# EAGLE board cpu (EAGLE 9.2.2), part 1 of 2
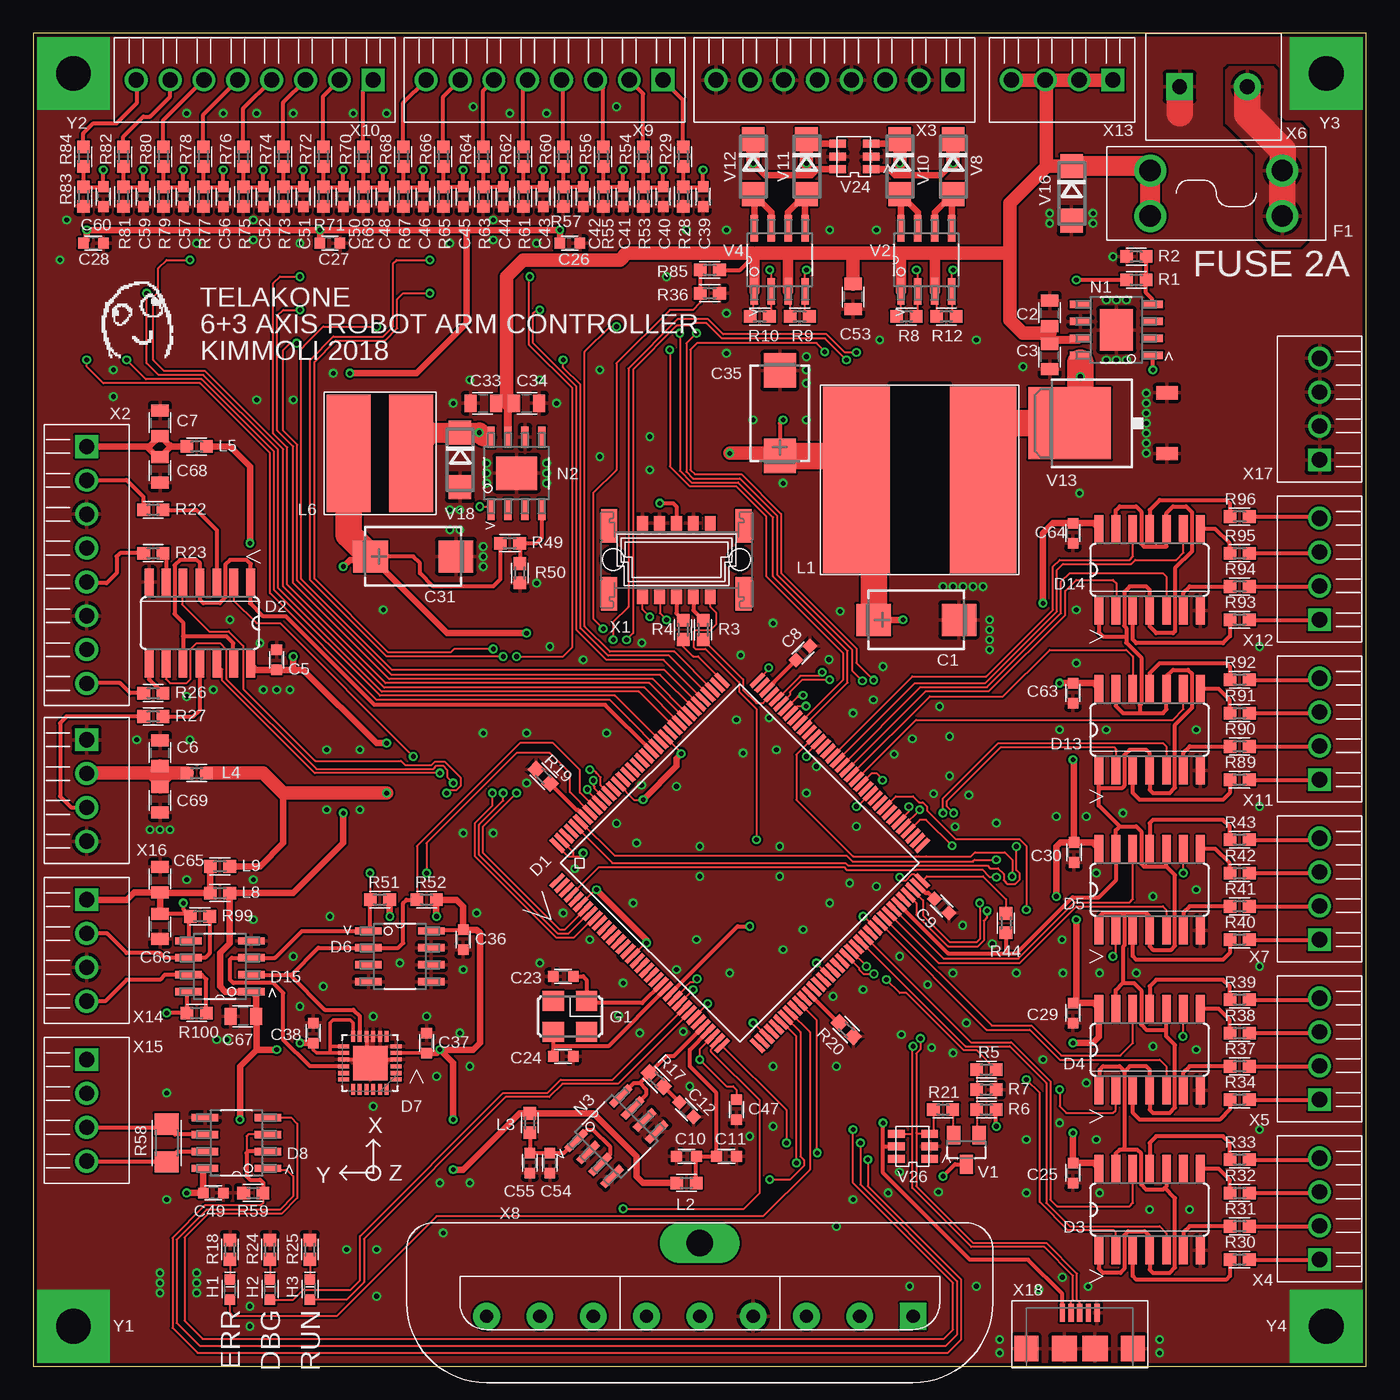
[diagram p8: board, top side]
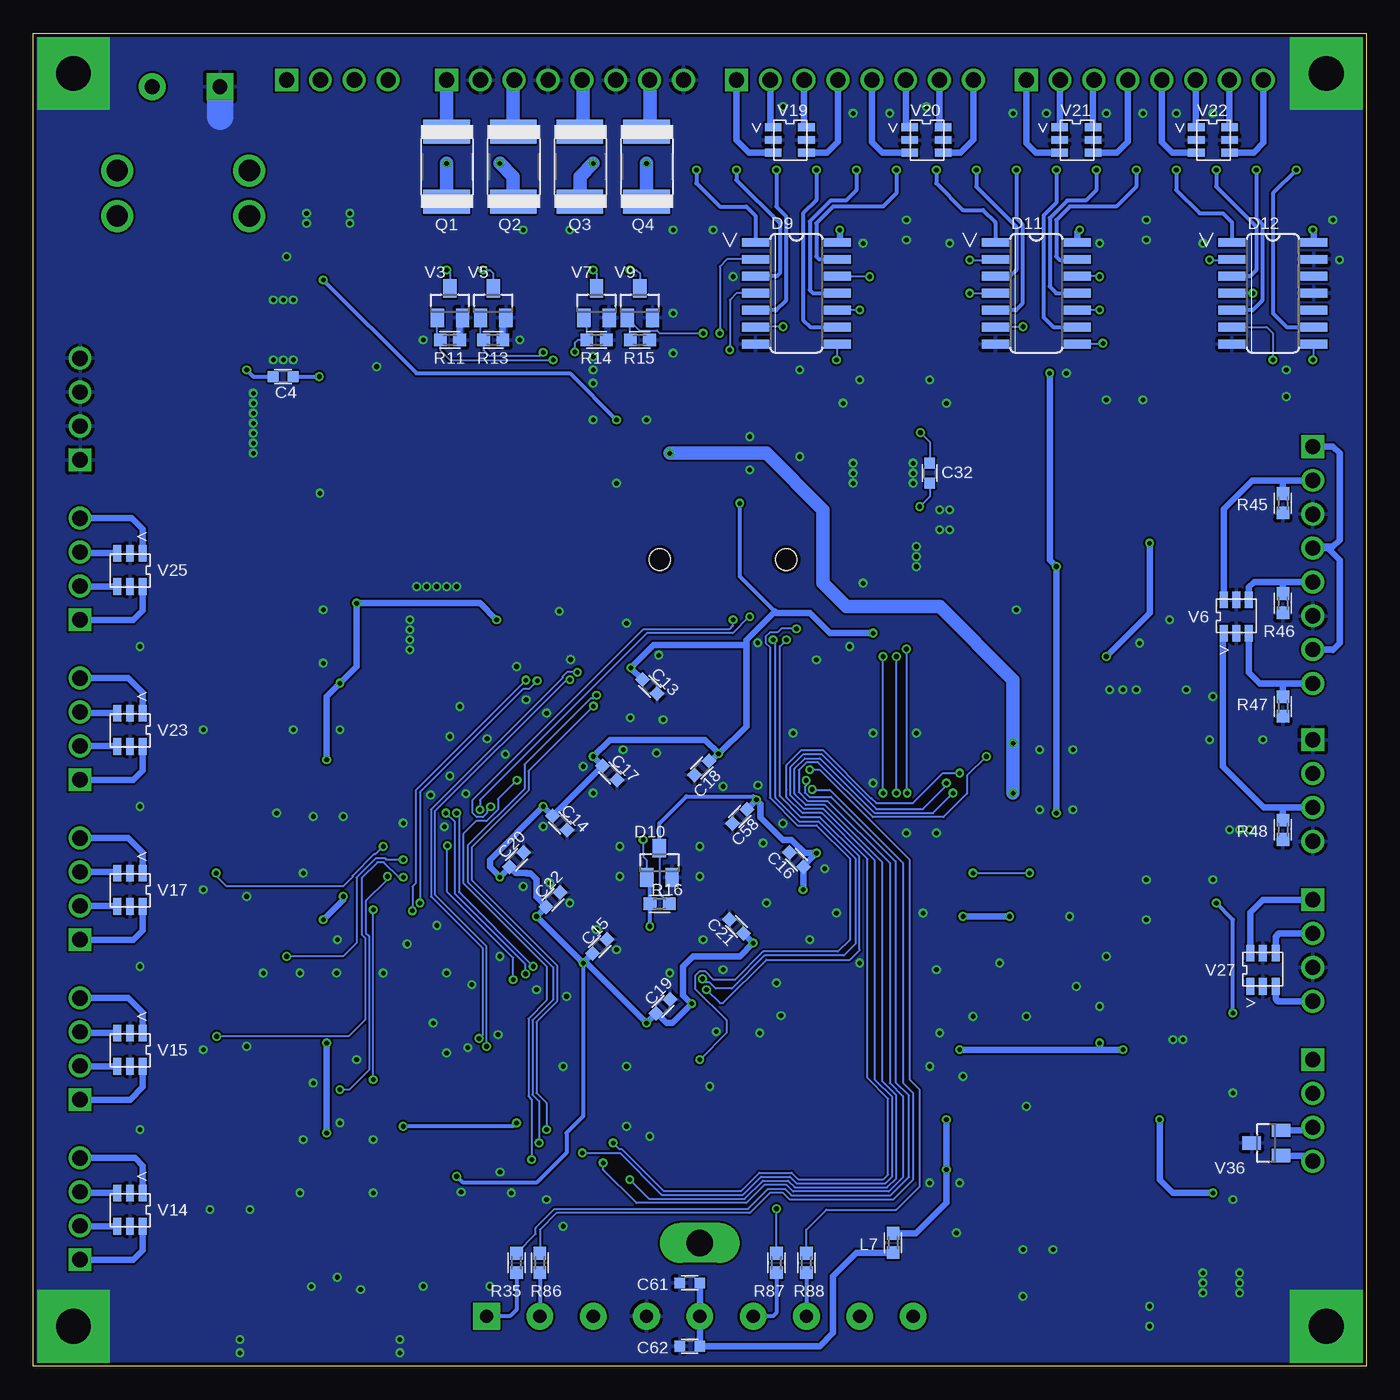
[diagram p9: board, bottom side, seen from below]

Size 100 x 100 mm. Coordinates in mm from the lower left corner, seen from the top.
Outline: 0,0 100,0 100,100 0,100 0,0
Copper layers (1*16): Top 0.035mm / dielectric 1.5mm / Bottom 0.035mm
Design rules "ITeadstudio": minimum track width 6mil, minimum drill 12mil, track to track 6mil, track to pad 6mil, pad to pad 6mil, via to via 6mil, smd to smd 0mil, copper to edge 10mil, drill to drill 10mil, minimum pad ring 10mil, minimum via ring 6mil, stop-mask expansion 2mil, vias tented up to drill 100mil, thermal gap 10mil
Net classes: 2 other: width 0.3 mm, drill 0.3 mm, clearance 1 mm to class 1
tRestrict: area 38.2,24.5 to 42.2,28; area 64.2,59.5 to 68.8,73.8; area 25.2,64 to 26.8,73

## Footprints (pad centres in the part's own frame; a part is rotated, then mirrored left to right if it is on the bottom)
CT7343 = smd 2.6 x 2.4: + 3.2,0; - -3.2,0
C0805 = smd 0.9 x 1.3: 1 -0.95,0; 2 0.95,0
C0603 = smd 0.8 x 0.8: 1 -0.75,0; 2 0.75,0
OMAT_IC_2_C0603 = smd 0.8 x 0.8: 1 -0.75,0; 2 0.75,0
OMAT_IC_2_C0805 = smd 0.9 x 1.3: 1 -0.95,0; 2 0.95,0
LQFP-144 = smd 0.34 x 1.35: 1 -8.75,-10.625; 2 -8.25,-10.625; 3 -7.75,-10.625; 4 -7.25,-10.625; 5 -6.75,-10.625; 6 -6.25,-10.625; 7 -5.75,-10.625; 8 -5.25,-10.625; 9 -4.75,-10.625; 10 -4.25,-10.625; 11 -3.75,-10.625; 12 -3.25,-10.625; 13 -2.75,-10.625; 14 -2.25,-10.625; 15 -1.75,-10.625; 16 -1.25,-10.625; 17 -0.75,-10.625; 18 -0.25,-10.625; 19 0.25,-10.625; 20 0.75,-10.625; 21 1.25,-10.625; 22 1.75,-10.625; 23 2.25,-10.625; 24 2.75,-10.625; 25 3.25,-10.625; 26 3.75,-10.625; 27 4.25,-10.625; 28 4.75,-10.625; 29 5.25,-10.625; 30 5.75,-10.625; 31 6.25,-10.625; 32 6.75,-10.625; 33 7.25,-10.625; 34 7.75,-10.625; 35 8.25,-10.625; 36 8.75,-10.625; 73 8.75,10.625; 74 8.25,10.625; 75 7.75,10.625; 76 7.25,10.625; 77 6.75,10.625; 78 6.25,10.625; 79 5.75,10.625; 80 5.25,10.625; 81 4.75,10.625; 82 4.25,10.625; 83 3.75,10.625; 84 3.25,10.625; 85 2.75,10.625; 86 2.25,10.625; 87 1.75,10.625; 88 1.25,10.625; 89 0.75,10.625; 90 0.25,10.625; 91 -0.25,10.625; 92 -0.75,10.625; 93 -1.25,10.625; 94 -1.75,10.625; 95 -2.25,10.625; 96 -2.75,10.625; 97 -3.25,10.625; 98 -3.75,10.625; 99 -4.25,10.625; 100 -4.75,10.625; 101 -5.25,10.625; 102 -5.75,10.625; 103 -6.25,10.625; 104 -6.75,10.625; 105 -7.25,10.625; 106 -7.75,10.625; 107 -8.25,10.625; 108 -8.75,10.625 | smd 1.35 x 0.34: 37 10.625,-8.75; 38 10.625,-8.25; 39 10.625,-7.75; 40 10.625,-7.25; 41 10.625,-6.75; 42 10.625,-6.25; 43 10.625,-5.75; 44 10.625,-5.25; 45 10.625,-4.75; 46 10.625,-4.25; 47 10.625,-3.75; 48 10.625,-3.25; 49 10.625,-2.75; 50 10.625,-2.25; 51 10.625,-1.75; 52 10.625,-1.25; 53 10.625,-0.75; 54 10.625,-0.25; 55 10.625,0.25; 56 10.625,0.75; 57 10.625,1.25; 58 10.625,1.75; 59 10.625,2.25; 60 10.625,2.75; 61 10.625,3.25; 62 10.625,3.75; 63 10.625,4.25; 64 10.625,4.75; 65 10.625,5.25; 66 10.625,5.75; 67 10.625,6.25; 68 10.625,6.75; 69 10.625,7.25; 70 10.625,7.75; 71 10.625,8.25; 72 10.625,8.75; 109 -10.625,8.75; 110 -10.625,8.25; 111 -10.625,7.75; 112 -10.625,7.25; 113 -10.625,6.75; 114 -10.625,6.25; 115 -10.625,5.75; 116 -10.625,5.25; 117 -10.625,4.75; 118 -10.625,4.25; 119 -10.625,3.75; 120 -10.625,3.25; 121 -10.625,2.75; 122 -10.625,2.25; 123 -10.625,1.75; 124 -10.625,1.25; 125 -10.625,0.75; 126 -10.625,0.25; 127 -10.625,-0.25; 128 -10.625,-0.75; 129 -10.625,-1.25; 130 -10.625,-1.75; 131 -10.625,-2.25; 132 -10.625,-2.75; 133 -10.625,-3.25; 134 -10.625,-3.75; 135 -10.625,-4.25; 136 -10.625,-4.75; 137 -10.625,-5.25; 138 -10.625,-5.75; 139 -10.625,-6.25; 140 -10.625,-6.75; 141 -10.625,-7.25; 142 -10.625,-7.75; 143 -10.625,-8.25; 144 -10.625,-8.75
SO14 = smd 0.66 x 2.032: 1 -3.81,-3.073; 2 -2.54,-3.073; 3 -1.27,-3.073; 4 0,-3.073; 5 1.27,-3.073; 6 2.54,-3.073; 7 3.81,-3.073; 8 3.81,3.073; 9 2.54,3.073; 10 1.27,3.073; 11 0,3.073; 12 -1.27,3.073; 13 -2.54,3.073; 14 -3.81,3.073
SOIC8-N_MC = smd 1.981 x 0.559: 1 -2.362,1.905; 2 -2.362,0.635; 3 -2.362,-0.635; 4 -2.362,-1.905; 5 2.362,-1.905; 6 2.362,-0.635; 7 2.362,0.635; 8 2.362,1.905
QFN50P400X400X100-25N = smd 0.813 x 0.305: 1 -1.981,1.245; 2 -1.981,0.762; 3 -1.981,0.254; 4 -1.981,-0.254; 5 -1.981,-0.762; 6 -1.981,-1.245; 13 1.981,-1.245; 14 1.981,-0.762; 15 1.981,-0.254; 16 1.981,0.254; 17 1.981,0.762; 18 1.981,1.245 | smd 0.305 x 0.813: 7 -1.245,-1.981; 8 -0.762,-1.981; 9 -0.254,-1.981; 10 0.254,-1.981; 11 0.762,-1.981; 12 1.245,-1.981; 19 1.245,1.981; 20 0.762,1.981; 21 0.254,1.981; 22 -0.254,1.981; 23 -0.762,1.981; 24 -1.245,1.981 | smd 2.591 x 2.591: 25 -0.025,0
SOT23 = smd 1 x 1.4: 1 -0.95,-1.1; 2 0.95,-1.1; 3 0,1.1
OMAT_IC_2_SOIC8-N_MC = smd 1.981 x 0.559: 1 -2.362,1.905; 2 -2.362,0.635; 3 -2.362,-0.635; 4 -2.362,-1.905; 5 2.362,-1.905; 6 2.362,-0.635; 7 2.362,0.635; 8 2.362,1.905
KEYSTONE-3568 = drill 1.6: 1 -4.96,1.7; 2 4.96,1.7; 3 4.96,-1.7; 4 -4.96,-1.7
X_3225 = smd 1.6 x 1.5: 1 -1.25,-1.15; 2 1.25,-1.15; 3 1.25,1.15; 4 -1.25,1.15
CHIP-LED0603 = smd 0.8 x 0.8: A -0.75,0; C 0.75,0
SDR1307 = smd 5 x 14: 1 -4.75,0; 2 4.75,0
R0603 = smd 0.95 x 0.95: 1 -0.725,0; 2 0.725,0
OMAT_IC_2_R0603 = smd 0.95 x 0.95: 1 -0.725,0; 2 0.725,0
VLP8040 = smd 3.3 x 8.8: 1 -2.35,0; 2 2.35,0
SOIC8-N-EP = smd 1.6 x 0.559: 1 -2.7,1.905; 2 -2.7,0.635; 3 -2.7,-0.635; 4 -2.7,-1.905; 5 2.7,-1.905; 6 2.7,-0.635; 7 2.7,0.635; 8 2.7,1.905 | smd 2.5 x 3.1: EP 0,0
OMAT_IC_2_R1812 = smd 1.8 x 3.5: 1 -2.625,0; 2 2.625,0
PASSIIVIT_R0603 = smd 0.95 x 0.95: 1 -0.725,0; 2 0.725,0
R1206 = smd 1.6 x 1.803: 1 -1.422,0; 2 1.422,0
OMAT_IC_2_SOT23 = smd 1 x 1.4: 1 -0.95,-1.1; 2 0.95,-1.1; 3 0,1.1
OMAT_IC_2_SOT23-6 = smd 1.25 x 0.6: 1 -1.25,0.95; 2 -1.25,0; 3 -1.25,-0.95; 4 1.25,-0.95; 5 1.25,0; 6 1.25,0.95
DO214AC = smd 1.8 x 1.7: A 2.05,0; C -2.05,0
DPACK = smd 1 x 1.6: 1 -2.28,-4.8; 3 2.28,-4.8 | smd 5.4 x 6.2: 2 0,2.5
SOT23-6 = smd 1.25 x 0.6: 1 -1.25,0.95; 2 -1.25,0; 3 -1.25,-0.95; 4 1.25,-0.95; 5 1.25,0; 6 1.25,0.95
LIITTIMET_15110102601 = smd 0.8 x 1.1: A1 -2.54,2.765; A2 -1.27,2.765; A3 0,2.765; A4 1.27,2.765; A5 2.54,2.765; B1 -2.54,-2.74; B2 -1.27,-2.74; B3 0,-2.74; B4 1.27,-2.74; B5 2.54,-2.74 | smd 1.2 x 2.5: M1 -5.045,2.55; M2 -5.045,-2.55; M3 5.045,-2.55; M4 5.045,2.55 | hole 1.6: -4.738,-0.022; 4.738,-0.022
OMAT_IC_2_MPT0.5/8-2.54 = drill 1.143 square: 1 0,0 | drill 1.143: 2 2.54,0; 3 5.08,0; 4 7.62,0; 5 10.16,0; 6 12.7,0; 7 15.24,0; 8 17.78,0
MPT0.5/8-2.54 = drill 1.143 square: 1 0,0 | drill 1.143: 2 2.54,0; 3 5.08,0; 4 7.62,0; 5 10.16,0; 6 12.7,0; 7 15.24,0; 8 17.78,0
MPT0.5/4-2.54 = drill 1.143 square: 1 0,0 | drill 1.143: 2 2.54,0; 3 5.08,0; 4 7.62,0
TE_RUUVILIITIN2 = drill 1.1 pad 2 square: 1 0,0 | drill 1.1 pad 2: 2 5.08,0
PS-JOYSTICK = drill 1 pad 2 square: 1 0,0 | drill 1 pad 2: 2 -4,0; 3 -8,0; 4 -12,0; 5 -16,0; 6 -20,0; 7 -24,0; 8 -28,0; 9 -32,0 | drill 2 long: 10 -16,5.5
629105136821 = smd 0.4 x 1.35: 1 -1.3,0; 2 -0.65,0; 3 0,0; 4 0.65,0; 5 1.3,0 | smd 1.8 x 1.9: Z1 -4,-2.675; Z4 4,-2.675 | smd 1.9 x 1.9: Z2 -1.15,-2.675; Z3 1.15,-2.675
PTH-2.6-5.5SQ = drill 2.6 pad 5.45 square: 1 0,0

## Placement (x,y rotation side)
C1  220u 16V D  [CT7343]  66.25,56 180 top
C2  2u2 50V 0805  [C0805]  76.25,79 90 top
C3  2u2 50V 0805  [C0805]  76.25,75.75 270 top
C4  10n  [C0603]  81.25,74.25 180 bottom
C5  [OMAT_IC_2_C0603]  18.25,53 90 top
C6  [OMAT_IC_2_C0805]  9.5,46 90 top
C7  [OMAT_IC_2_C0805]  9.5,70.75 90 top
C8  2u2  [C0603]  57.75,53.5 45 top
C9  2u2  [C0603]  68.15,34.53 315 top
C10  100n  [C0603]  49,15.75 180 top
C11  2u2  [C0603]  52,15.75 0 top
C12  2u2  [C0603]  49,19.25 315 top
C13  100n  [C0603]  53.75,51 315 bottom
C14  100n  [C0603]  60.5,40.75 315 bottom
C15  100n  [C0603]  57.5,31.5 45 bottom
C16  100n  [C0603]  42.75,38 135 bottom
C17  100n  [C0603]  56.75,44.5 315 bottom
C18  100n  [C0603]  49.85,44.88 225 bottom
C19  100n  [C0603]  52.75,27 45 bottom
C20  100n  [C0603]  63.75,38 45 bottom
C21  100n  [C0603]  47.25,33 135 bottom
C22  100n  [C0603]  61,35 45 bottom
C23  22p  [C0603]  39.75,29.25 180 top
C24  22p  [C0603]  39.75,23.25 0 top
C25  [OMAT_IC_2_C0603]  78,14.5 270 top
C26  100n  [C0603]  40.25,84.25 0 top
C27  100n  [C0603]  22.25,84.25 0 top
C28  100n  [C0603]  4.5,84.25 0 top
C29  [OMAT_IC_2_C0603]  78,26.5 270 top
C30  [OMAT_IC_2_C0603]  78.08,38.54 270 top
C31  220u 16V D  [CT7343]  28.5,60.75 180 top
C32  10n  [C0603]  32.75,67 270 bottom
C33  2u2 50V 0805  [C0805]  33.75,72.25 180 top
C34  2u2 50V 0805  [C0805]  37,72.25 0 top
C35  220u 16V D  [CT7343]  56,71.5 270 top
C36  100n  [C0603]  32.25,32 270 top
C37  100n  [C0603]  29.5,24.25 90 top
C38  2u2  [C0603]  21,25 90 top
C39  10n  [OMAT_IC_2_C0603]  50.25,87.75 270 top
C40  [OMAT_IC_2_C0603]  47.25,87.75 270 top
C41  [OMAT_IC_2_C0603]  44.25,87.75 270 top
C42  [OMAT_IC_2_C0603]  41.25,87.75 270 top
C43  [OMAT_IC_2_C0603]  38.25,87.75 270 top
C44  [OMAT_IC_2_C0603]  35.25,87.75 270 top
C45  [OMAT_IC_2_C0603]  32.25,87.75 270 top
C46  [OMAT_IC_2_C0603]  29.25,87.75 270 top
C47  10n  [C0603]  52.75,19.25 270 top
C48  [OMAT_IC_2_C0603]  26.25,87.75 270 top
C49  100n  [C0603]  13.5,13 0 top
C50  [OMAT_IC_2_C0603]  23.25,87.75 270 top
C51  [OMAT_IC_2_C0603]  20.25,87.75 270 top
C52  [OMAT_IC_2_C0603]  17.25,87.75 270 top
C53  2u2 50V 0805  [C0805]  61.5,80.25 270 top
C54  2u2  [C0603]  38.75,15.25 270 top
C55  100n  [C0603]  37.25,15.25 270 top
C56  [OMAT_IC_2_C0603]  14.25,87.75 270 top
C57  [OMAT_IC_2_C0603]  11.25,87.75 270 top
C58  100n  [C0603]  47,41.25 225 bottom
C59  [OMAT_IC_2_C0603]  8.25,87.75 270 top
C60  [OMAT_IC_2_C0603]  5.25,87.75 270 top
C61  100n  [C0603]  50.75,6.25 180 bottom
C62  2u2  [C0603]  50.75,1.5 180 bottom
C63  [OMAT_IC_2_C0603]  78,50.5 270 top
C64  [OMAT_IC_2_C0603]  78,62.5 270 top
C65  [OMAT_IC_2_C0805]  9.5,36.5 90 top
C66  [OMAT_IC_2_C0805]  9.5,33 270 top
C67  [OMAT_IC_2_C0805]  15.75,26.25 180 top
C68  [OMAT_IC_2_C0805]  9.5,67.25 270 top
C69  [OMAT_IC_2_C0805]  9.5,42.5 270 top
D1  STM32F407ZG  [LQFP-144]  53,37.75 315 top
D2  74AHCT125  [SO14]  12.5,55.75 180 top
D3  74AHCT125  [SO14]  83.75,11.75 0 top
D4  74AHCT125  [SO14]  83.75,23.75 0 top
D5  74AHCT125  [SO14]  83.75,35.75 0 top
D6  LM75BD  [SOIC8-N_MC]  27.5,30.75 0 top
D7  IIS328DQTR  [QFN50P400X400X100-25N]  25.25,22.75 180 top
D8  MAX3430_SA  [SOIC8-N_MC]  15.25,16.75 180 top
D9  74AHC14  [SO14]  42.75,80.5 270 bottom
D10  RT9818C-29GV  [SOT23]  53.03,37.77 0 bottom
D11  74AHC14  [SO14]  24.75,80.5 270 bottom
D12  74AHC14  [SO14]  7,80.5 270 bottom
D13  74AHCT125  [SO14]  83.75,47.75 0 top
D14  74AHCT125  [SO14]  83.75,59.75 0 top
D15  PCA9517  [OMAT_IC_2_SOIC8-N_MC]  14,30 180 top
F1  MINIBLADE-FUSEHOLDER-3568  [KEYSTONE-3568]  88.75,88 180 top
G1  25MHz  [X_3225]  40.25,26.25 180 top
H1  RED  [CHIP-LED0603]  14.75,5.75 90 top
H2  GRN  [CHIP-LED0603]  17.75,5.75 90 top
H3  GRN  [CHIP-LED0603]  20.75,5.75 90 top
L1  SDR1307-15UH  [SDR1307]  66.5,66.5 180 top
L2  IND0603  [R0603]  49,13.75 180 top
L3  IND0603  [R0603]  37.25,18.25 90 top
L4  IND0603  [OMAT_IC_2_R0603]  12.25,44.5 0 top
L5  IND0603  [OMAT_IC_2_R0603]  12.25,69 0 top
L6  VLP8040-47U  [VLP8040]  26,68.5 180 top
L7  IND0603  [R0603]  35.5,9.25 90 bottom
L8  IND0603  [OMAT_IC_2_R0603]  14,35.5 0 top
L9  IND0603  [OMAT_IC_2_R0603]  14,37.5 180 top
N1  TPS5430DDA  [SOIC8-N-EP]  81.25,77.75 180 top
N2  TPS5430DDA  [SOIC8-N-EP]  36.25,67 90 top
N3  MCP1501/SN  [SOIC8-N_MC]  43.75,17.25 45 top
Q1  PTC  [OMAT_IC_2_R1812]  69,90 90 bottom
Q2  PTC  [OMAT_IC_2_R1812]  64,90 90 bottom
Q3  PTC  [OMAT_IC_2_R1812]  59,90 90 bottom
Q4  PTC  [OMAT_IC_2_R1812]  54,90 90 bottom
R1  10k0  [R0603]  82.75,81.5 0 top
R2  3k24  [R0603]  82.75,83.25 180 top
R3  100R  [PASSIIVIT_R0603]  50.25,55.25 270 top
R4  100R  [PASSIIVIT_R0603]  48.75,55.25 270 top
R5  100R  [PASSIIVIT_R0603]  71.5,22.25 0 top
R6  31k6  [PASSIIVIT_R0603]  71.5,20.75 180 top
R7  10k0  [PASSIIVIT_R0603]  71.5,19.25 0 top
R8  2k00  [R0603]  65.5,78.75 180 top
R9  2k00  [R0603]  57.5,78.75 180 top
R10  2k00  [R0603]  54.5,78.75 180 top
R11  2k00  [R0603]  68.75,77 0 bottom
R12  2k00  [R0603]  68.5,78.75 180 top
R13  2k00  [R0603]  65.5,77 0 bottom
R14  2k00  [R0603]  57.75,77 0 bottom
R15  2k00  [R0603]  54.5,77 0 bottom
R16  2k00  [R0603]  53.01,34.69 0 bottom
R17  1k00  [R0603]  46.75,21.5 135 top
R18  499  [R0603]  14.75,8.75 270 top
R19  2k00  [R0603]  38.25,44.25 315 top
R20  2k00  [R0603]  61,25.25 135 top
R21  1k47  [PASSIIVIT_R0603]  68.25,19.25 0 top
R22  [OMAT_IC_2_R0603]  9,64.25 180 top
R23  [OMAT_IC_2_R0603]  9,61 180 top
R24  499  [R0603]  17.75,8.75 270 top
R25  499  [R0603]  20.75,8.75 270 top
R26  [OMAT_IC_2_R0603]  9,50.5 180 top
R27  [OMAT_IC_2_R0603]  9,48.75 180 top
R28  2k2  [OMAT_IC_2_R0603]  48.75,87.75 90 top
R29  5k90  [OMAT_IC_2_R0603]  48.75,90.75 90 top
R30  [OMAT_IC_2_R0603]  90.5,8 0 top
R31  [OMAT_IC_2_R0603]  90.5,10.5 0 top
R32  [OMAT_IC_2_R0603]  90.5,13 0 top
R33  [OMAT_IC_2_R0603]  90.5,15.5 0 top
R34  [OMAT_IC_2_R0603]  90.5,20 0 top
R35  [OMAT_IC_2_R0603]  63.75,7.75 90 bottom
R36  825  [R0603]  50.75,80.5 180 top
R37  [OMAT_IC_2_R0603]  90.5,22.5 0 top
R38  [OMAT_IC_2_R0603]  90.5,25 0 top
R39  [OMAT_IC_2_R0603]  90.5,27.5 0 top
R40  [OMAT_IC_2_R0603]  90.5,32 0 top
R41  [OMAT_IC_2_R0603]  90.5,34.5 0 top
R42  [OMAT_IC_2_R0603]  90.5,37 0 top
R43  [OMAT_IC_2_R0603]  90.5,39.5 0 top
R44  [OMAT_IC_2_R0603]  72.97,33.24 90 top
R45  [OMAT_IC_2_R0603]  6.25,64.75 90 bottom
R46  [OMAT_IC_2_R0603]  6.25,57.25 90 bottom
R47  [OMAT_IC_2_R0603]  6.25,49.5 90 bottom
R48  [OMAT_IC_2_R0603]  6.25,40.25 90 bottom
R49  10k0  [R0603]  35.75,61.75 0 top
R50  5k90  [R0603]  36.5,59.5 270 top
R51  2k00  [R0603]  26,35 0 top
R52  2k00  [R0603]  29.5,35 0 top
R53  [OMAT_IC_2_R0603]  45.75,87.75 90 top
R54  [OMAT_IC_2_R0603]  45.75,90.75 90 top
R55  [OMAT_IC_2_R0603]  42.75,87.75 90 top
R56  [OMAT_IC_2_R0603]  42.75,90.75 90 top
R57  [OMAT_IC_2_R0603]  39.75,87.75 90 top
R58  121 1206  [R1206]  10,16.75 90 top
R59  2k00  [R0603]  16.5,13 0 top
R60  [OMAT_IC_2_R0603]  39.75,90.75 90 top
R61  [OMAT_IC_2_R0603]  36.75,87.75 90 top
R62  [OMAT_IC_2_R0603]  36.75,90.75 90 top
R63  [OMAT_IC_2_R0603]  33.75,87.75 90 top
R64  [OMAT_IC_2_R0603]  33.75,90.75 90 top
R65  [OMAT_IC_2_R0603]  30.75,87.75 90 top
R66  [OMAT_IC_2_R0603]  30.75,90.75 90 top
R67  [OMAT_IC_2_R0603]  27.75,87.75 90 top
R68  [OMAT_IC_2_R0603]  27.75,90.75 90 top
R69  [OMAT_IC_2_R0603]  24.75,87.75 90 top
R70  [OMAT_IC_2_R0603]  24.75,90.75 90 top
R71  [OMAT_IC_2_R0603]  21.75,87.75 90 top
R72  [OMAT_IC_2_R0603]  21.75,90.75 90 top
R73  [OMAT_IC_2_R0603]  18.75,87.75 90 top
R74  [OMAT_IC_2_R0603]  18.75,90.75 90 top
R75  [OMAT_IC_2_R0603]  15.75,87.75 90 top
R76  [OMAT_IC_2_R0603]  15.75,90.75 90 top
R77  [OMAT_IC_2_R0603]  12.75,87.75 90 top
R78  [OMAT_IC_2_R0603]  12.75,90.75 90 top
R79  [OMAT_IC_2_R0603]  9.75,87.75 90 top
R80  [OMAT_IC_2_R0603]  9.75,90.75 90 top
R81  [OMAT_IC_2_R0603]  6.75,87.75 90 top
R82  [OMAT_IC_2_R0603]  6.75,90.75 90 top
R83  [OMAT_IC_2_R0603]  3.75,87.75 90 top
R84  [OMAT_IC_2_R0603]  3.75,90.75 90 top
R85  5k90  [R0603]  50.75,82.25 180 top
R86  [OMAT_IC_2_R0603]  62,7.75 90 bottom
R87  [OMAT_IC_2_R0603]  44.25,7.75 90 bottom
R88  [OMAT_IC_2_R0603]  42,7.75 90 bottom
R89  [OMAT_IC_2_R0603]  90.5,44 0 top
R90  [OMAT_IC_2_R0603]  90.5,46.5 0 top
R91  [OMAT_IC_2_R0603]  90.5,49 0 top
R92  [OMAT_IC_2_R0603]  90.5,51.5 0 top
R93  [OMAT_IC_2_R0603]  90.5,56 0 top
R94  [OMAT_IC_2_R0603]  90.5,58.5 0 top
R95  [OMAT_IC_2_R0603]  90.5,61 0 top
R96  [OMAT_IC_2_R0603]  90.5,63.75 0 top
R99  2k00  [R0603]  12.5,33.75 180 top
R100  2k00  [R0603]  12.25,26.5 180 top
U$1  DAFUG  [DAFUG]  8,78.25 0 top
V1  2N3904  [OMAT_IC_2_SOT23]  70,16.25 180 top
V2  AO4803A  [SOIC8-N_MC]  67,83 90 top
V3  2N7002K  [SOT23]  68.75,79.75 0 bottom
V4  AO4803A  [SOIC8-N_MC]  56,83 90 top
V5  2N7002K  [SOT23]  65.5,79.75 0 bottom
V6  ESDAXXSC6  [OMAT_IC_2_SOT23-6]  9.75,56.25 90 bottom
V7  2N7002K  [SOT23]  57.75,79.75 0 bottom
V8  SK34A  [DO214AC]  69,90 270 top
V9  2N7002K  [SOT23]  54.5,79.75 0 bottom
V10  SK34A  [DO214AC]  65,90 270 top
V11  SK34A  [DO214AC]  58,90 270 top
V12  SK34A  [DO214AC]  54,90 270 top
V13  SBRD10200  [DPACK]  80.25,70.75 90 top
V14  ESDAXXSC6  [OMAT_IC_2_SOT23-6]  92.75,11.75 270 bottom
V15  ESDAXXSC6  [OMAT_IC_2_SOT23-6]  92.75,23.75 270 bottom
V16  SMAJ20A  [DO214AC]  77.89,87.98 270 top
V17  ESDAXXSC6  [OMAT_IC_2_SOT23-6]  92.75,35.75 270 bottom
V18  SK34A  [DO214AC]  32,68 270 top
V19  ESDAXXSC6  [OMAT_IC_2_SOT23-6]  43.25,92 0 bottom
V20  ESDAXXSC6  [OMAT_IC_2_SOT23-6]  33,92 0 bottom
V21  ESDAXXSC6  [OMAT_IC_2_SOT23-6]  21.75,92 0 bottom
V22  ESDAXXSC6  [OMAT_IC_2_SOT23-6]  11.5,92 0 bottom
V23  ESDAXXSC6  [OMAT_IC_2_SOT23-6]  92.75,47.75 270 bottom
V24  ESDA19SC6  [SOT23-6]  61.61,90.76 180 top
V25  ESDAXXSC6  [OMAT_IC_2_SOT23-6]  92.75,59.75 270 bottom
V26  SRV05-4  [OMAT_IC_2_SOT23-6]  66,16.5 180 top
V27  ESDAXXSC6  [OMAT_IC_2_SOT23-6]  7.75,29.75 90 bottom
V36  SM712  [SOT23]  7.5,16.75 90 bottom
X1  LIITTIMET_X3815-10  [LIITTIMET_15110102601]  48.25,60.5 180 top
X2  MPT0.5/8-2.54  [OMAT_IC_2_MPT0.5/8-2.54]  4,69 270 top
X3  MPT0.5/8-2.54  [MPT0.5/8-2.54]  69,96.5 180 top
X4  MPT0.5/4-2.54  [MPT0.5/4-2.54]  96.5,8 90 top
X5  MPT0.5/4-2.54  [MPT0.5/4-2.54]  96.5,20 90 top
X6  [TE_RUUVILIITIN2]  86,96 0 top
X7  MPT0.5/4-2.54  [MPT0.5/4-2.54]  96.5,32 90 top
X8  PS-JOYSTICK  [PS-JOYSTICK]  66,3.75 0 top
X9  MPT0.5/8-2.54  [OMAT_IC_2_MPT0.5/8-2.54]  47.25,96.5 180 top
X10  MPT0.5/8-2.54  [OMAT_IC_2_MPT0.5/8-2.54]  25.5,96.5 180 top
X11  MPT0.5/4-2.54  [MPT0.5/4-2.54]  96.5,44 90 top
X12  MPT0.5/4-2.54  [MPT0.5/4-2.54]  96.5,56 90 top
X13  MPT0.5/4-2.54  [MPT0.5/4-2.54]  81,96.5 180 top
X14  MPT0.5/4-2.54  [MPT0.5/4-2.54]  4,35 270 top
X15  MPT0.5/4-2.54  [MPT0.5/4-2.54]  4,23 270 top
X16  MPT0.5/4-2.54  [MPT0.5/4-2.54]  4,47 270 top
X17  MPT0.5/4-2.54  [MPT0.5/4-2.54]  96.5,68 90 top
X18  629105136821  [629105136821]  78.5,4 0 top
Y1  PTH2.6-5.5SQ  [PTH-2.6-5.5SQ]  3,3 0 top
Y2  PTH2.6-5.5SQ  [PTH-2.6-5.5SQ]  3,97 0 top
Y3  PTH2.6-5.5SQ  [PTH-2.6-5.5SQ]  97,97 0 top
Y4  PTH2.6-5.5SQ  [PTH-2.6-5.5SQ]  97,3 0 top